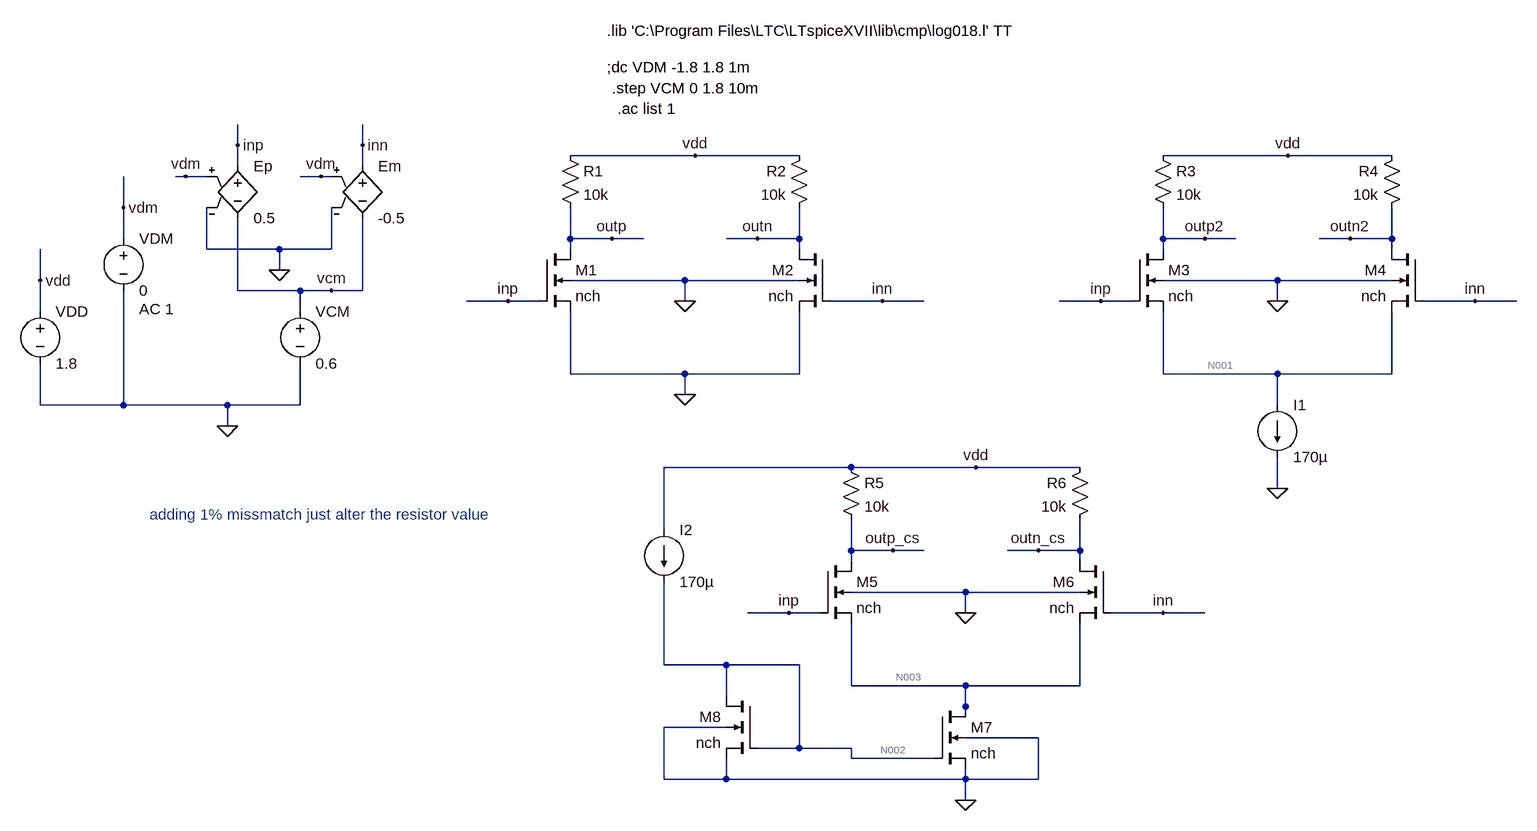
[diagram p0: schematic Week4_Ex1.asc]
Week4_Ex1.asc, the LTspice schematic file:
Version 4
SHEET 1 2388 1204
WIRE 416 176 416 144
WIRE 608 176 608 144
WIRE 1120 192 928 192
WIRE 1280 192 1120 192
WIRE 2032 192 1840 192
WIRE 2192 192 2032 192
WIRE 416 208 416 176
WIRE 608 208 608 176
WIRE 336 224 320 224
WIRE 368 224 336 224
WIRE 544 224 512 224
WIRE 560 224 544 224
WIRE 240 272 240 224
WIRE 240 320 240 272
WIRE 928 320 928 272
WIRE 992 320 928 320
WIRE 1040 320 992 320
WIRE 1216 320 1168 320
WIRE 1280 320 1280 272
WIRE 1280 320 1216 320
WIRE 1840 320 1840 272
WIRE 1904 320 1840 320
WIRE 1952 320 1904 320
WIRE 2128 320 2080 320
WIRE 2192 320 2192 272
WIRE 2192 320 2128 320
WIRE 368 336 368 272
WIRE 480 336 368 336
WIRE 560 336 560 272
WIRE 560 336 480 336
WIRE 928 336 928 320
WIRE 1280 336 1280 320
WIRE 1840 336 1840 320
WIRE 2192 336 2192 320
WIRE 480 368 480 336
WIRE 112 384 112 336
WIRE 1104 384 928 384
WIRE 1280 384 1104 384
WIRE 2016 384 1840 384
WIRE 2192 384 2016 384
WIRE 416 400 416 288
WIRE 512 400 416 400
WIRE 560 400 512 400
WIRE 608 400 608 288
WIRE 608 400 560 400
WIRE 832 416 768 416
WIRE 880 416 832 416
WIRE 1104 416 1104 384
WIRE 1408 416 1328 416
WIRE 1472 416 1408 416
WIRE 1744 416 1680 416
WIRE 1792 416 1744 416
WIRE 2016 416 2016 384
WIRE 2320 416 2240 416
WIRE 2384 416 2320 416
WIRE 112 432 112 384
WIRE 512 432 512 400
WIRE 928 528 928 432
WIRE 1104 528 928 528
WIRE 1280 528 1280 432
WIRE 1280 528 1104 528
WIRE 1840 528 1840 432
WIRE 2016 528 1840 528
WIRE 2192 528 2192 432
WIRE 2192 528 2016 528
WIRE 1104 560 1104 528
WIRE 112 576 112 512
WIRE 240 576 240 400
WIRE 240 576 112 576
WIRE 400 576 240 576
WIRE 512 576 512 512
WIRE 512 576 400 576
WIRE 2016 576 2016 528
WIRE 400 608 400 576
WIRE 1360 672 1072 672
WIRE 1552 672 1360 672
WIRE 1712 672 1552 672
WIRE 2016 704 2016 656
WIRE 1072 768 1072 672
WIRE 1360 800 1360 752
WIRE 1424 800 1360 800
WIRE 1472 800 1424 800
WIRE 1648 800 1600 800
WIRE 1712 800 1712 752
WIRE 1712 800 1648 800
WIRE 1360 816 1360 800
WIRE 1712 816 1712 800
WIRE 1536 864 1360 864
WIRE 1712 864 1536 864
WIRE 1264 896 1200 896
WIRE 1312 896 1264 896
WIRE 1536 896 1536 864
WIRE 1840 896 1760 896
WIRE 1904 896 1840 896
WIRE 1072 976 1072 848
WIRE 1168 976 1072 976
WIRE 1280 976 1168 976
WIRE 1360 1008 1360 912
WIRE 1536 1008 1360 1008
WIRE 1712 1008 1712 912
WIRE 1712 1008 1536 1008
WIRE 1168 1024 1168 976
WIRE 1536 1040 1536 1008
WIRE 1536 1056 1536 1040
WIRE 1168 1072 1072 1072
WIRE 1648 1088 1536 1088
WIRE 1280 1104 1280 976
WIRE 1280 1104 1216 1104
WIRE 1360 1104 1280 1104
WIRE 1360 1120 1360 1104
WIRE 1488 1120 1360 1120
WIRE 1072 1152 1072 1072
WIRE 1168 1152 1168 1120
WIRE 1168 1152 1072 1152
WIRE 1536 1152 1536 1136
WIRE 1536 1152 1168 1152
WIRE 1648 1152 1648 1088
WIRE 1648 1152 1536 1152
WIRE 1536 1184 1536 1152
FLAG 1104 560 0
FLAG 832 416 inp
FLAG 1408 416 inn
FLAG 992 320 outp
FLAG 1216 320 outn
FLAG 1120 192 vdd
FLAG 1104 416 0
FLAG 400 608 0
FLAG 112 384 vdd
FLAG 416 176 inp
FLAG 608 176 inn
FLAG 480 368 0
FLAG 336 224 vdm
FLAG 544 224 vdm
FLAG 240 272 vdm
FLAG 560 400 vcm
FLAG 2016 704 0
FLAG 1744 416 inp
FLAG 2320 416 inn
FLAG 1904 320 outp2
FLAG 2128 320 outn2
FLAG 2032 192 vdd
FLAG 2016 416 0
FLAG 1536 1184 0
FLAG 1264 896 inp
FLAG 1840 896 inn
FLAG 1424 800 outp_cs
FLAG 1648 800 outn_cs
FLAG 1552 672 vdd
FLAG 1536 896 0
SYMBOL nmos4 880 336 R0
SYMATTR InstName M1
SYMATTR Value nch
SYMATTR Value2 l=1u w=20u
SYMBOL res 912 176 R0
SYMATTR InstName R1
SYMATTR Value 10k
SYMBOL nmos4 1328 336 M0
SYMATTR InstName M2
SYMATTR Value nch
SYMATTR Value2 l=1u w=20u
SYMBOL res 1296 176 M0
SYMATTR InstName R2
SYMATTR Value 10k
SYMBOL voltage 512 416 R0
WINDOW 123 0 0 Left 0
WINDOW 39 0 0 Left 0
SYMATTR InstName VCM
SYMATTR Value 0.6
SYMBOL voltage 112 416 R0
WINDOW 123 0 0 Left 0
WINDOW 39 0 0 Left 0
SYMATTR InstName VDD
SYMATTR Value 1.8
SYMBOL e 416 192 R0
SYMATTR InstName Ep
SYMATTR Value 0.5
SYMBOL voltage 240 304 R0
WINDOW 123 24 124 Left 2
WINDOW 39 0 0 Left 0
SYMATTR Value2 AC 1
SYMATTR InstName VDM
SYMATTR Value 0
SYMBOL e 608 192 R0
SYMATTR InstName Em
SYMATTR Value -0.5
SYMBOL nmos4 1792 336 R0
SYMATTR InstName M3
SYMATTR Value nch
SYMATTR Value2 l=1u w=20u
SYMBOL res 1824 176 R0
SYMATTR InstName R3
SYMATTR Value 10k
SYMBOL nmos4 2240 336 M0
SYMATTR InstName M4
SYMATTR Value nch
SYMATTR Value2 l=1u w=20u
SYMBOL res 2208 176 M0
SYMATTR InstName R4
SYMATTR Value 10k
SYMBOL current 2016 576 R0
WINDOW 123 0 0 Left 0
WINDOW 39 0 0 Left 0
SYMATTR InstName I1
SYMATTR Value 170µ
SYMBOL nmos4 1312 816 R0
SYMATTR InstName M5
SYMATTR Value nch
SYMATTR Value2 l=1u w=20u
SYMBOL res 1344 656 R0
SYMATTR InstName R5
SYMATTR Value 10k
SYMBOL nmos4 1760 816 M0
SYMATTR InstName M6
SYMATTR Value nch
SYMATTR Value2 l=1u w=20u
SYMBOL res 1728 656 M0
SYMATTR InstName R6
SYMATTR Value 10k
SYMBOL nmos4 1488 1040 R0
SYMATTR InstName M7
SYMATTR Value nch
SYMATTR Value2 l=1u w=20u
SYMBOL nmos4 1216 1024 M0
SYMATTR InstName M8
SYMATTR Value nch
SYMATTR Value2 l=1u w=20u
SYMBOL current 1072 768 R0
WINDOW 123 0 0 Left 0
WINDOW 39 0 0 Left 0
SYMATTR InstName I2
SYMATTR Value 170µ
TEXT 984 0 Left 2 !.lib 'C:\\Program Files\\LTC\\LTspiceXVII\\lib\\cmp\\log018.l' TT
TEXT 984 56 Left 2 !;dc VDM -1.8 1.8 1m
TEXT 992 88 Left 2 !.step VCM 0 1.8 10m
TEXT 1000 120 Left 2 !.ac list 1
TEXT 280 744 Left 2 ;adding 1% missmatch just alter the resistor value

The netlist it stands for:
* Week4_Ex1.asc
M1 outp inp 0 0 nch l=1u w=20u
R1 vdd outp 10k
M2 outn inn 0 0 nch l=1u w=20u
R2 vdd outn 10k
VCM vcm 0 0.6
VDD vdd 0 1.8
Ep inp vcm vdm 0 0.5
VDM vdm 0 0 AC 1
Em inn vcm vdm 0 -0.5
M3 outp2 inp N001 0 nch l=1u w=20u
R3 vdd outp2 10k
M4 outn2 inn N001 0 nch l=1u w=20u
R4 vdd outn2 10k
I1 N001 0 170µ
M5 outp_cs inp N003 0 nch l=1u w=20u
R5 vdd outp_cs 10k
M6 outn_cs inn N003 0 nch l=1u w=20u
R6 vdd outn_cs 10k
M7 N003 N002 0 0 nch l=1u w=20u
M8 N002 N002 0 0 nch l=1u w=20u
I2 vdd N002 170µ
.model NMOS NMOS
.model PMOS PMOS
.lib standard.mos
.lib 'C:\Program Files\LTC\LTspiceXVII\lib\cmp\log018.l' TT
;dc VDM -1.8 1.8 1m
.step VCM 0 1.8 10m
.ac list 1
* adding 1% missmatch just alter the resistor value
.backanno
.end

* Results of the author's LTspice run, read from the files saved beside the schematic
* Operating Point (first step), zero values left out:
*   V(outp) = 1.8 V
*   V(vdd) = 1.8 V
*   V(outn) = 1.8 V
*   V(outp2) = 964.2 mV
*   V(n001) = -485.7 mV
*   V(outn2) = 964.2 mV
*   V(outp_cs) = 1.8 V
*   V(n003) = 56.6 nV
*   V(outn_cs) = 1.8 V
*   V(n002) = 669.2 mV
*   Id(M8) = 170 µA
*   Is(M8) = -170 µA
*   Id(M7) = 80.75 pA
*   Is(M7) = -80.75 pA
*   Id(M6) = 42.23 pA
*   Ib(M6) = -1.852 pA
*   Is(M6) = -40.37 pA
*   Id(M5) = 42.23 pA
*   Ib(M5) = -1.852 pA
*   Is(M5) = -40.37 pA
*   Id(M4) = 83.58 µA
*   Ib(M4) = 1.423 µA
*   Is(M4) = -85 µA
*   Id(M3) = 83.58 µA
*   Ib(M3) = 1.423 µA
*   Is(M3) = -85 µA
*   Id(M2) = 42.23 pA
*   Ib(M2) = -1.852 pA
*   Is(M2) = -40.37 pA
*   Id(M1) = 42.23 pA
*   Ib(M1) = -1.852 pA
*   Is(M1) = -40.37 pA
*   I(I2) = 170 µA
*   I(I1) = 170 µA
*   I(R6) = 42.23 pA
*   I(R5) = 42.23 pA
*   I(R4) = 83.58 µA
*   I(R3) = 83.58 µA
*   I(R2) = 42.23 pA
*   I(R1) = 42.23 pA
*   I(Vdd) = -337.2 µA
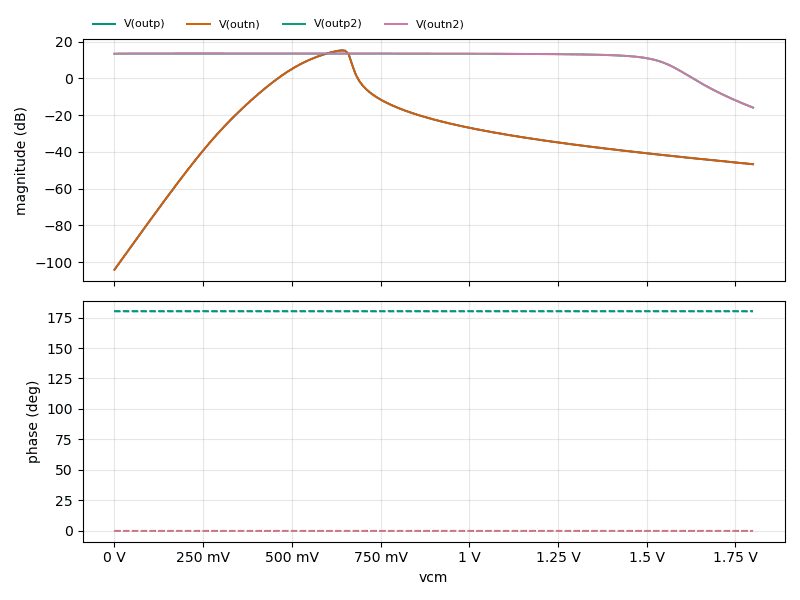
[diagram p1: AC Analysis of Week4_Ex1.asc, plotted from the saved traces]
* AC Analysis, 1 run:
*   V(outp): -104.06 dB at 0 Hz, -46.68 dB at 1.8 Hz, peak 15.25 dB at 640 mHz, 3 dB below the peak at 577.5 mHz and 661.7 mHz
*   V(outn): -104.06 dB at 0 Hz, -46.68 dB at 1.8 Hz, peak 15.25 dB at 640 mHz, 3 dB below the peak at 577.5 mHz and 661.7 mHz
*   V(outp2): 13.45 dB at 0 Hz, -15.87 dB at 1.8 Hz, peak 13.55 dB at 340 mHz, 3 dB below the peak at 1.513 Hz
*   V(outn2): 13.45 dB at 0 Hz, -15.87 dB at 1.8 Hz, peak 13.55 dB at 340 mHz, 3 dB below the peak at 1.513 Hz